# Altium schematic sheet Switched_Outputs.SchDoc: 4 Port Switch Card Top Level
size A4; Date: June 2003; CheckedBy: Bonne Eggleston; Author: Johanna May; Organization: UNSW Solar Racing Team; Address3: UNSW; Address4: Sydney NSW 2052; SheetNumber: 1; SheetTotal: 2; Address2: Electrical Engineering; Address1: Rm 109
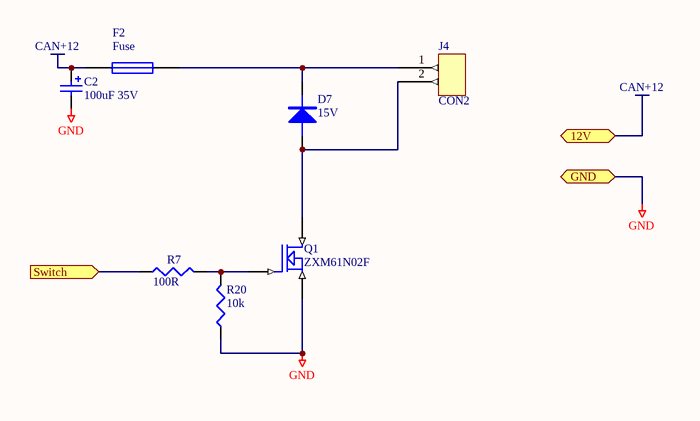
[diagram p0: Switched_Outputs.SchDoc]

## Parts
C2  100uF 35V  [MCCT-CASED]
D7  15V  [SMB]
F2  Fuse  [LITTELFUSE-154]
J4  CON2  [MICROFIT-2]
Q1  ZXM61N02F  [SOT23(3)]
R7  100R  [0603]
R20  10k  [0603]

## Ports
12V (bidir), GND (bidir), Switch (in)

## Nets
CAN+12: C2.1 F2.1 ; port 12V
GND: C2.2 Q1.2(S) R20.1 ; port GND
Switch: R7.1 ; port Switch
NetD7_A: D7.A J4.2 Q1.3(D)
NetD7_K: D7.K F2.2 J4.1
NetQ1_1: Q1.1(G) R7.2 R20.2

## Notes on the sheet
- Title
- Size:
- Date:
- A4
- Number:
- Time:
- Revision:
- Sheet
- of
- File:

## Library data of the parts
C2 = Cap Pol3: Polarized Capacitor (Surface Mount); Value: 4.7uF; Revision: July-2002: Re-released for DXP Platform.; Farnell: 967-294; Price: 1.97
D7 = DIODE: Farnell: 302-3096; Price: 1.25
J4 = CON2: Connector; Farnell: 673-031; Price: 2.67
Q1 = ZXM61N02F: 1.7A, 20V N-Channel Enhancement mode FET; Farnell: 325-6194; Price: 0.75
R7 R20 = RES1: Farnell: 911-112; Price: 0.119
F2 = FUSE: Farnell: 664-960; Price: 5.26